# EAGLE design kulgurpowerMCU (EAGLE 6.3)

## Sheet 1 of 4
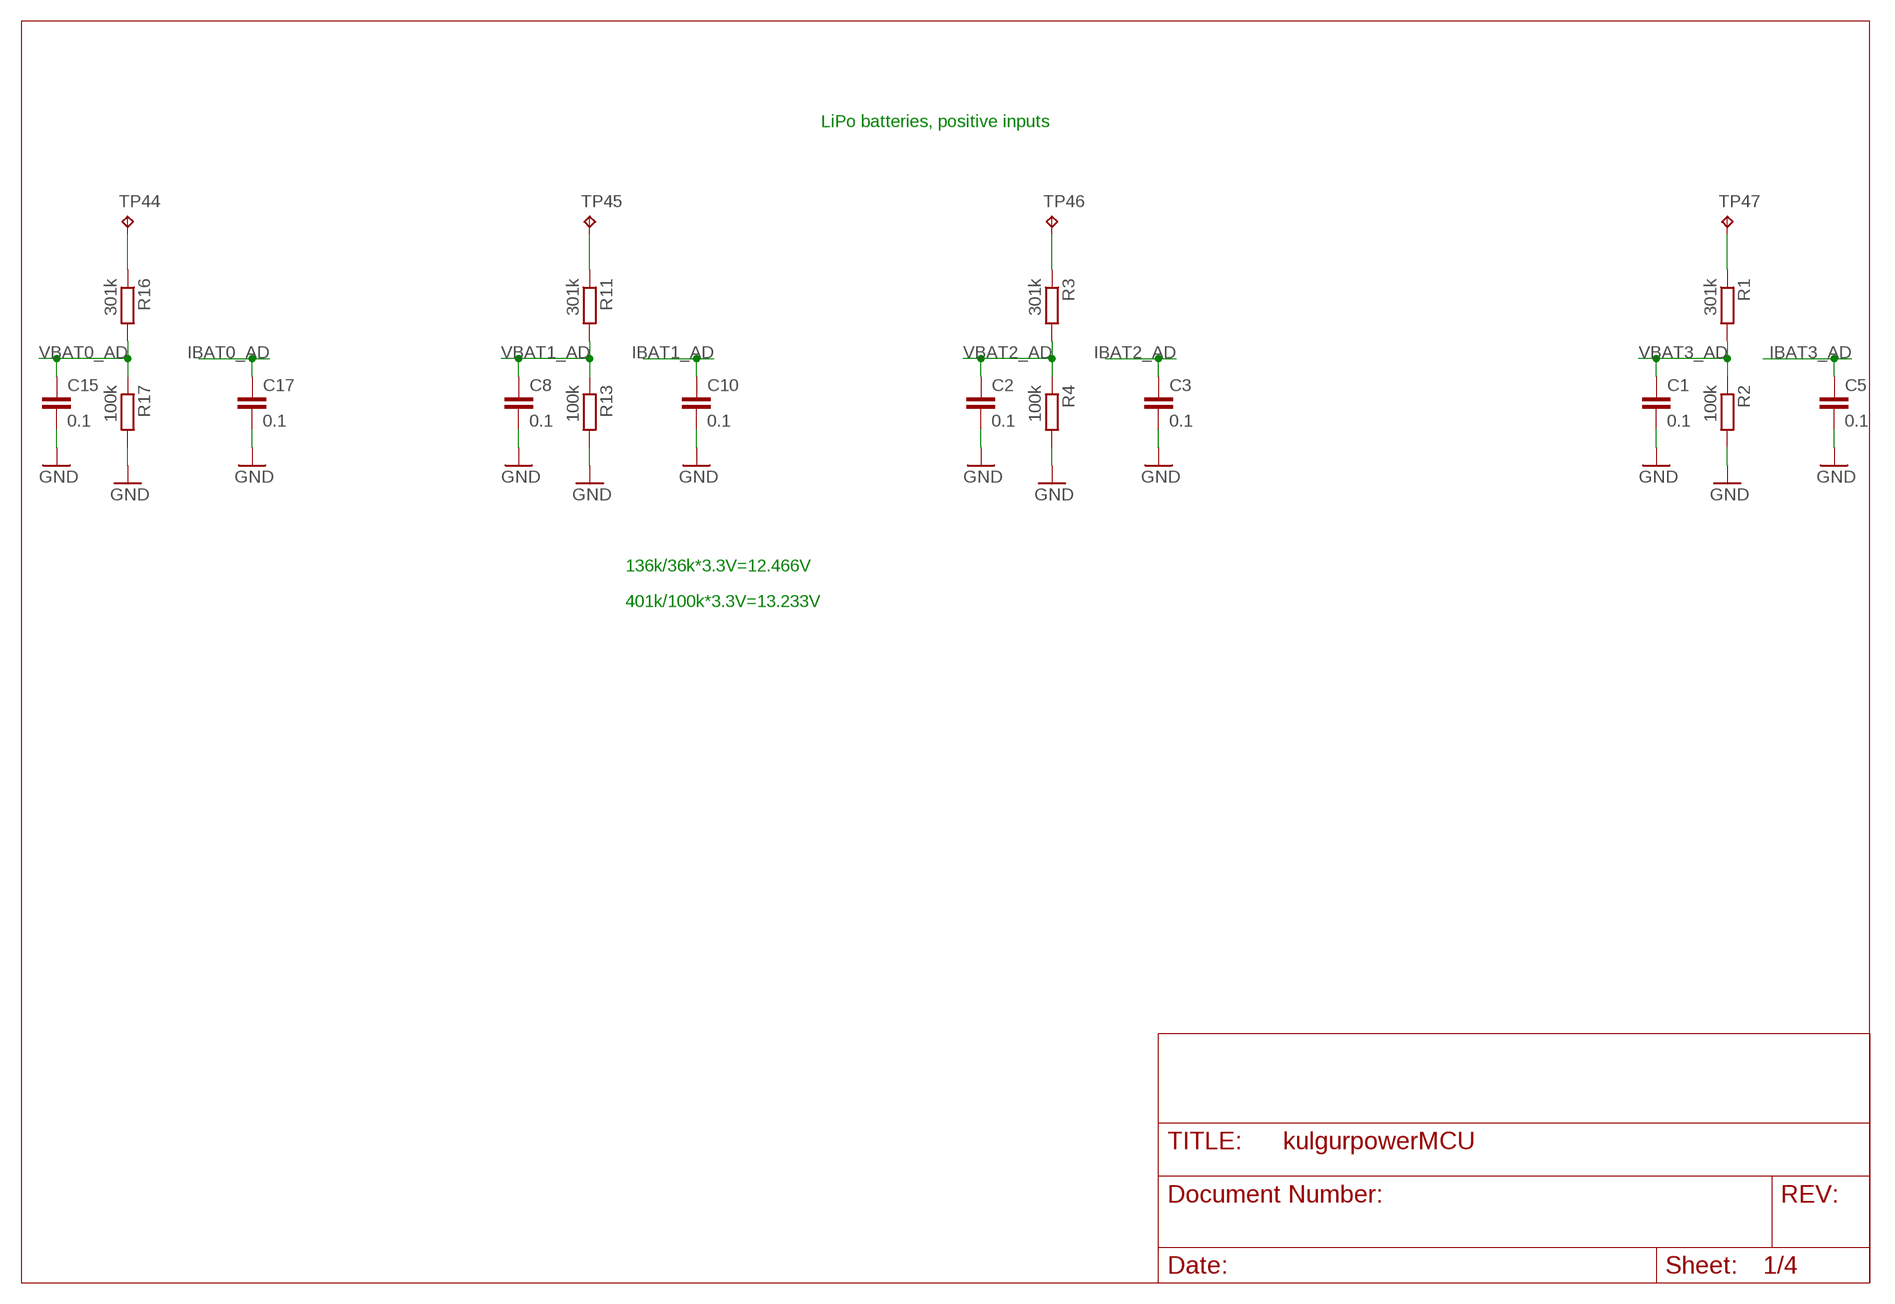
[diagram p0: schematic, sheet 1]

### Parts
C1  0.1  C-EUC0603  [C0603]
C2  0.1  C-EUC0603  [C0603]
C3  0.1  C-EUC0603  [C0603]
C5  0.1  C-EUC0603  [C0603]
C8  0.1  C-EUC0603  [C0603]
C10  0.1  C-EUC0603  [C0603]
C15  0.1  C-EUC0603  [C0603]
C17  0.1  C-EUC0603  [C0603]
R1  301k  R-EU_R0603  [R0603]
R2  100k  R-EU_R0603  [R0603]
R3  301k  R-EU_R0603  [R0603]
R4  100k  R-EU_R0603  [R0603]
R11  301k  R-EU_R0603  [R0603]
R13  100k  R-EU_R0603  [R0603]
R16  301k  R-EU_R0603  [R0603]
R17  100k  R-EU_R0603  [R0603]
TP44  TPB1,27  [B1,27]
TP45  TPB1,27  [B1,27]
TP46  TPB1,27  [B1,27]
TP47  TPB1,27  [B1,27]

### Nets
GND [gnd]: C1.2 C2.2 C3.2 C5.2 C8.2 C10.2 C15.2 C17.2 R2.2 R4.2 R13.2 R17.2 ; also sheet 2,3
IBAT0_AD: C17.1 ; also sheet 2
IBAT1_AD: C10.1 ; also sheet 2
IBAT2_AD: C3.1 ; also sheet 2
IBAT3_AD: C5.1 ; also sheet 2
N$10: R3.1 TP46.TP
N$13: R11.1 TP45.TP
N$22: R16.1 TP44.TP
N$24: R1.1 TP47.TP
VBAT0_AD: C15.1 R16.2 R17.1 ; also sheet 2
VBAT1_AD: C8.1 R11.2 R13.1 ; also sheet 2
VBAT2_AD: C2.1 R3.2 R4.1 ; also sheet 2
VBAT3_AD: C1.1 R1.2 R2.1 ; also sheet 2

### Notes on the sheet
- LiPo batteries, positive inputs
- 136k/36k*3.3V=12.466V
- 401k/100k*3.3V=13.233V

## Sheet 2 of 4
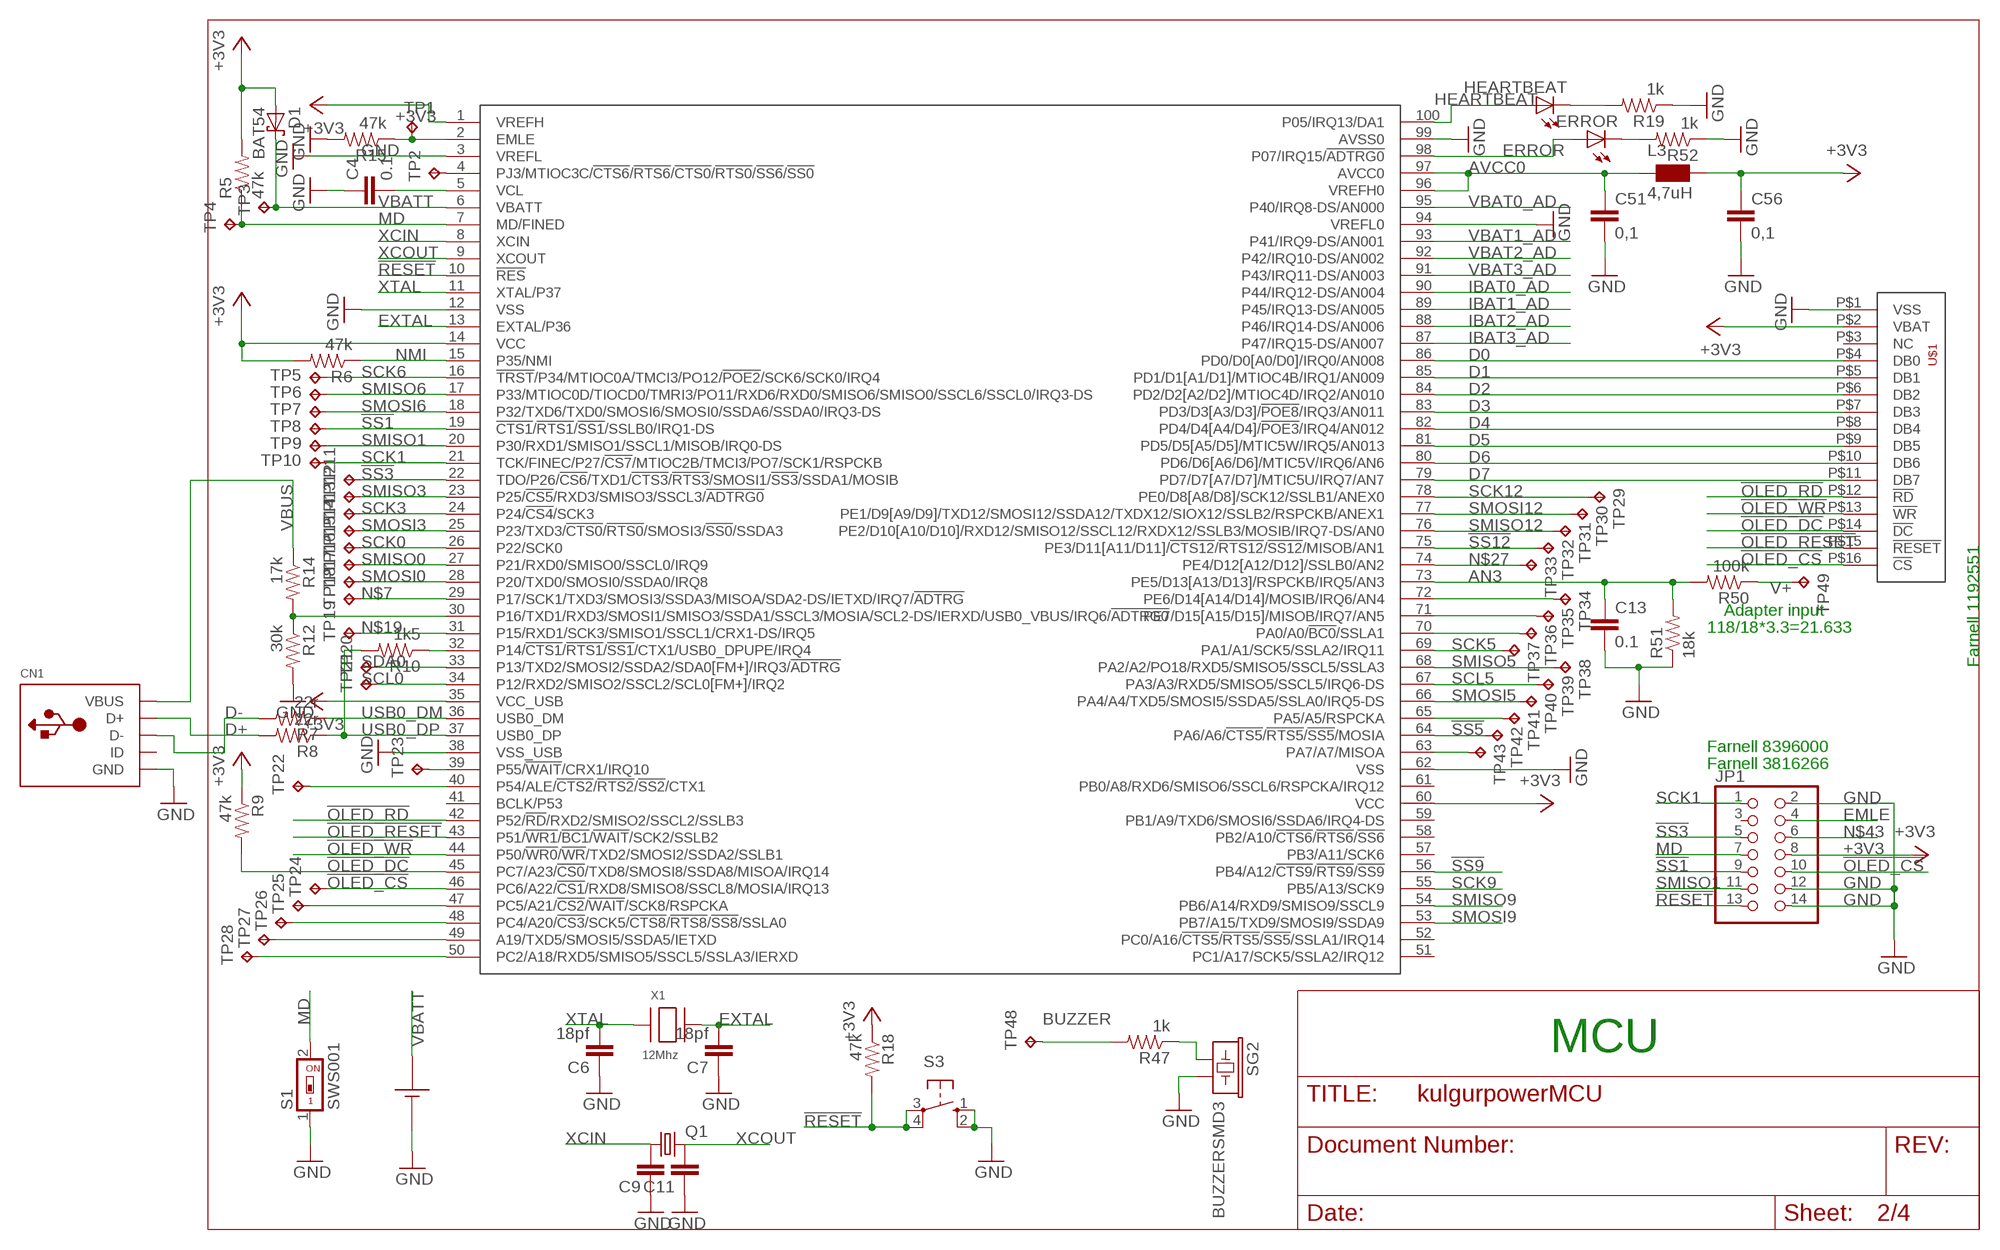
[diagram p1: schematic, sheet 2]

### Parts
C4  0.1  CAP0603-CAP  [0603-CAP]
C6  18pf  CAP0603-CAP  [0603-CAP]
C7  18pf  CAP0603-CAP  [0603-CAP]
C9  CAP0603-CAP  [0603-CAP]
C11  CAP0603-CAP  [0603-CAP]
C13  0.1  CAP0603-CAP  [0603-CAP]
C51  0,1  CAP0603-CAP  [0603-CAP]
C56  0,1  CAP0603-CAP  [0603-CAP]
CN1  USBMINIB  [USB-MINIB]
D1  BAT54  [SOT23]
ERROR  LED0603  [LED-0603]
HEARTBEAT  LED0603  [LED-0603]
JP1  PINHD-2X7  [2X07]
L3  4,7uH  WE-KIHQ_0805  [WE-KI_0805_B]
Q1  CRYSTALMM20SS  [MM20SS]
R5  47k  RESISTOR0603-RES  [0603-RES]
R6  47k  RESISTOR0603-RES  [0603-RES]
R7  22r  RESISTOR0603-RES  [0603-RES]
R8  22r  RESISTOR0603-RES  [0603-RES]
R9  47k  RESISTOR0603-RES  [0603-RES]
R10  1k5  RESISTOR0603-RES  [0603-RES]
R12  30k  RESISTOR0603-RES  [0603-RES]
R14  17k  RESISTOR0603-RES  [0603-RES]
R15  47k  RESISTOR0603-RES  [0603-RES]
R18  47k  RESISTOR0603-RES  [0603-RES]
R19  1k  RESISTOR0603-RES  [0603-RES]
R47  1k  RESISTOR0603-RES  [0603-RES]
R50  100k  RESISTOR0603-RES  [0603-RES]
R51  18k  RESISTOR0603-RES  [0603-RES]
R52  1k  RESISTOR0603-RES  [0603-RES]
S1  SWS001  [SMS-001]
S3  10-XX  [B3F-10XX]
SG2  BUZZERSMD3  [BUZZER-CMT1102]
TP1  TPB2,54  [B2,54]
TP2  TPB2,54  [B2,54]
TP3  TPB2,54  [B2,54]
TP4  TPB2,54  [B2,54]
TP5  TPB1,27  [B1,27]
TP6  TPB1,27  [B1,27]
TP7  TPB1,27  [B1,27]
TP8  TPB1,27  [B1,27]
TP9  TPB1,27  [B1,27]
TP10  TPB1,27  [B1,27]
TP11  TPB1,27  [B1,27]
TP12  TPB1,27  [B1,27]
TP13  TPB1,27  [B1,27]
TP14  TPB1,27  [B1,27]
TP15  TPB1,27  [B1,27]
TP16  TPB1,27  [B1,27]
TP17  TPB1,27  [B1,27]
TP18  TPB1,27  [B1,27]
TP19  TPB1,27  [B1,27]
TP20  TPB1,27  [B1,27]
TP21  TPB1,27  [B1,27]
TP22  TPB1,27  [B1,27]
TP23  TPB1,27  [B1,27]
TP24  TPB1,27  [B1,27]
TP25  TPB1,27  [B1,27]
TP26  TPB1,27  [B1,27]
TP27  TPB1,27  [B1,27]
TP28  TPB1,27  [B1,27]
TP29  TPB1,27  [B1,27]
TP30  TPB1,27  [B1,27]
TP31  TPB1,27  [B1,27]
TP32  TPB1,27  [B1,27]
TP33  TPB1,27  [B1,27]
TP34  TPB1,27  [B1,27]
TP35  TPB1,27  [B1,27]
TP36  TPB1,27  [B1,27]
TP37  TPB1,27  [B1,27]
TP38  TPB1,27  [B1,27]
TP39  TPB1,27  [B1,27]
TP40  TPB1,27  [B1,27]
TP41  TPB1,27  [B1,27]
TP42  TPB1,27  [B1,27]
TP43  TPB1,27  [B1,27]
TP48  TPB1,27  [B1,27]
TP49  TPB1,27  [B1,27]
U$1  ER-OLEDM032-1  [ER-OLEDM032-1]
U$2  EDLRD224V3R6C  [EDLRD224V3R6C]
U$14  R5F5630ADDFP  [LTQFP100]
X1  12Mhz  XTALNX5032  [NX5032]

### Nets
!OLED_CS: JP1.10 TP24.TP U$1.P$16(!CS) U$14.46(PC6/A22/!CS1!/RXD8/SMISO8/SSCL8/MOSIA/IRQ13)
!OLED_DC: R9.2 U$1.P$14(!DC) U$14.45(PC7/A23/!CS0!/TXD8/SMOSI8/SSDA8/MISOA/IRQ14)
!OLED_RD: U$1.P$12(!RD) U$14.42(P52/!RD!/RXD2/SMISO2/SSCL2/SSLB3)
!OLED_RESET: U$1.P$15(!RESET) U$14.43(P51/!WR1!/!BC1!/!WAIT!/SCK2/SSLB2)
!OLED_WR: U$1.P$13(!WR) U$14.44(P50/!WR0!/!WR!/TXD2/SMOSI2/SSDA2/SSLB1)
!RESET: JP1.13 R18.2 S3.3(P) S3.4(P1) U$14.10(!RES!) ; also sheet 3
!SS1: JP1.9 TP8.TP U$14.19(!CTS1!/!RTS1!/!SS1!/SSLB0/IRQ1-DS)
!SS3: JP1.5 TP11.TP U$14.22(TDO/P26/!CS6!/TXD1/!CTS3!/!RTS3!/SMOSI1/!SS3!/SSDA1/MOSIB)
!SS5: TP42.TP U$14.64(PA6/A6/!CTS5!/!RTS5!/!SS5!/MOSIA)
!SS9: U$14.56(PB4/A12/!CTS9!/!RTS9!/!SS9!)
!SS12: TP32.TP U$14.75(PE3/D11[A11/D11]/!CTS12!/!RTS12!/!SS12!/MISOB/AN1)
+3V3 [morepower]: C56.1 D1.1(A) JP1.8 L3.1 R5.2 R6.2 R9.1 R18.1 U$1.P$2(VBAT) U$14.1(VREFH) U$14.14(VCC) U$14.35(VCC_USB) U$14.60(VCC) ; also sheet 3
AN3: C13.1 R50.2 R51.2 U$14.73(PE5/D13[A13/D13]/RSPCKB/IRQ5/AN3)
AVCC0: C51.1 L3.2 U$14.96(VREFH0) U$14.97(AVCC0)
BUZZER: R47.2 TP48.TP
D0: U$1.P$4(DB0) U$14.86(PD0/D0[A0/D0]/IRQ0/AN008)
D1: U$1.P$5(DB1) U$14.85(PD1/D1[A1/D1]/MTIOC4B/IRQ1/AN009)
D2: U$1.P$6(DB2) U$14.84(PD2/D2[A2/D2]/MTIOC4D/IRQ2/AN010)
D3: U$1.P$7(DB3) U$14.83(PD3/D3[A3/D3]/!POE8!/IRQ3/AN011)
D4: U$1.P$8(DB4) U$14.82(PD4/D4[A4/D4]/!POE3!/IRQ4/AN012)
D5: U$1.P$9(DB5) U$14.81(PD5/D5[A5/D5]/MTIC5W/IRQ5/AN013)
D6: U$1.P$10(DB6) U$14.80(PD6/D6[A6/D6]/MTIC5V/IRQ6/AN6)
D7: U$1.P$11(DB7) U$14.79(PD7/D7[A7/D7]/MTIC5U/IRQ7/AN7)
D+: CN1.D+ R8.2
D-: CN1.D- R7.2
EMLE: JP1.4 R15.1 TP1.TP U$14.2(EMLE)
EN_PANDA: R47.1 SG2.1
ERROR: ERROR.A U$14.98(P07/IRQ15/!ADTRG0)
EXTAL: C7.2 U$14.13(EXTAL/P36) X1.P$2
GND [gnd]: C4.1 C6.1 C7.1 C9.1 C11.1 C13.2 C51.2 C56.2 CN1.GND JP1.2 JP1.12 JP1.14 R12.2 R15.2 R19.1 R51.1 R52.1 S1.1 S3.1(S) S3.2(S1) SG2.2 U$1.P$1(VSS) U$2.N U$14.3(VREFL) U$14.12(VSS) U$14.38(VSS_USB) U$14.62(VSS) U$14.94(VREFL0) U$14.99(AVSS0) ; also sheet 1,3
HEARTBEAT: HEARTBEAT.A U$14.100(P05/IRQ13/DA1)
IBAT0_AD: U$14.90(P44/IRQ12-DS/AN004) ; also sheet 1
IBAT1_AD: U$14.89(P45/IRQ13-DS/AN005) ; also sheet 1
IBAT2_AD: U$14.88(P46/IRQ14-DS/AN006) ; also sheet 1
IBAT3_AD: U$14.87(P47/IRQ15-DS/AN007) ; also sheet 1
MD: JP1.7 R5.1 S1.2 TP4.TP U$14.7(MD/FINED)
N$1: R10.1 U$14.32(P14/!CTS1!/!RTS1!/!SS1!/CTX1/USB0_DPUPE/IRQ4)
N$2: R12.1 R14.2 U$14.30(P16/TXD1/RXD3/SMOSI1/SMISO3/SSDA1/SSCL3/MOSIA/SCL2-DS/IERXD/USB0_VBUS/IRQ6/!ADTRG0!)
N$3: C4.2 U$14.5(VCL)
N$7: TP18.TP U$14.29(P17/SCK1/TXD3/SMOSI3/SSDA3/MISOA/SDA2-DS/IETXD/IRQ7/!ADTRG!)
N$12: TP25.TP U$14.47(PC5/A21/!CS2!/!WAIT!/SCK8/RSPCKA)
N$14: TP26.TP U$14.48(PC4/A20/!CS3!/SCK5/!CTS8!/!RTS8!/!SS8!/SSLA0)
N$15: TP27.TP U$14.49(A19/TXD5/SMOSI5/SSDA5/IETXD)
N$17: HEARTBEAT.C R19.2
N$18: TP28.TP U$14.50(PC2/A18/RXD5/SMISO5/SSCL5/SSLA3/IERXD)
N$19: TP19.TP U$14.31(P15/RXD1/SCK3/SMISO1/SSCL1/CRX1-DS/IRQ5)
N$21: TP2.TP U$14.4(PJ3/MTIOC3C/!CTS6!/!RTS6!/!CTS0!/!RTS0!/!SS6!/!SS0!)
N$25: TP22.TP U$14.40(P54/ALE/!CTS2!/!RTS2!/!SS2!/CTX1)
N$27: TP33.TP U$14.74(PE4/D12[A12/D12]/SSLB0/AN2)
N$28: TP23.TP U$14.39(P55/!WAIT!/CRX1/IRQ10)
N$29: ERROR.C R52.2
N$31: TP34.TP U$14.72(PE6/D14[A14/D14]/MOSIB/IRQ6/AN4)
N$32: TP35.TP U$14.71(PE7/D15[A15/D15]/MISOB/IRQ7/AN5)
N$33: TP36.TP U$14.70(PA0/A0/!BC0!/SSLA1)
N$34: TP41.TP U$14.65(PA5/A5/RSPCKA)
N$35: TP43.TP U$14.63(PA7/A7/MISOA)
N$43: JP1.6
NMI: R6.1 U$14.15(P35/NMI)
SCK0: TP15.TP U$14.26(P22/SCK0)
SCK1: JP1.1 TP10.TP U$14.21(TCK/FINEC/P27/!CS7!/MTIOC2B/TMCI3/PO7/SCK1/RSPCKB)
SCK3: TP13.TP U$14.24(P24/!CS4!/SCK3)
SCK5: TP37.TP U$14.69(PA1/A1/SCK5/SSLA2/IRQ11)
SCK6: TP5.TP U$14.16(!TRST!/P34/MTIOC0A/TMCI3/PO12/!POE2!/SCK6/SCK0/IRQ4)
SCK9: U$14.55(PB5/A13/SCK9)
SCK12: TP29.TP U$14.78(PE0/D8[A8/D8]/SCK12/SSLB1/ANEX0)
SCL0: TP21.TP U$14.34(P12/RXD2/SMISO2/SSCL2/SCL0[FM+]/IRQ2)
SCL5: TP39.TP U$14.67(PA3/A3/RXD5/SMISO5/SSCL5/IRQ6-DS)
SDA0: TP20.TP U$14.33(P13/TXD2/SMOSI2/SSDA2/SDA0[FM+]/IRQ3/!ADTRG!)
SMISO0: TP16.TP U$14.27(P21/RXD0/SMISO0/SSCL0/IRQ9)
SMISO1: JP1.11 TP9.TP U$14.20(P30/RXD1/SMISO1/SSCL1/MISOB/IRQ0-DS)
SMISO3: TP12.TP U$14.23(P25/!CS5!/RXD3/SMISO3/SSCL3/!ADTRG0!)
SMISO5: TP38.TP U$14.68(PA2/A2/PO18/RXD5/SMISO5/SSCL5/SSLA3)
SMISO6: TP6.TP U$14.17(P33/MTIOC0D/TIOCD0/TMRI3/PO11/RXD6/RXD0/SMISO6/SMISO0/SSCL6/SSCL0/IRQ3-DS)
SMISO9: U$14.54(PB6/A14/RXD9/SMISO9/SSCL9)
SMISO12: TP31.TP U$14.76(PE2/D10[A10/D10]/RXD12/SMISO12/SSCL12/RXDX12/SSLB3/MOSIB/IRQ7-DS/AN0)
SMOSI0: TP17.TP U$14.28(P20/TXD0/SMOSI0/SSDA0/IRQ8)
SMOSI3: TP14.TP U$14.25(P23/TXD3/!CTS0!/!RTS0!/SMOSI3/!SS0!/SSDA3)
SMOSI5: TP40.TP U$14.66(PA4/A4/TXD5/SMOSI5/SSDA5/SSLA0/IRQ5-DS)
SMOSI6: TP7.TP U$14.18(P32/TXD6/TXD0/SMOSI6/SMOSI0/SSDA6/SSDA0/IRQ3-DS)
SMOSI9: U$14.53(PB7/A15/TXD9/SMOSI9/SSDA9)
SMOSI12: TP30.TP U$14.77(PE1/D9[A9/D9]/TXD12/SMOSI12/SSDA12/TXDX12/SIOX12/SSLB2/RSPCKB/ANEX1)
USB0_DM: R7.1 U$14.36(USB0_DM)
USB0_DP: R8.1 R10.2 U$14.37(USB0_DP)
V+ [morepower]: R50.1 TP49.TP
VBAT0_AD: U$14.95(P40/IRQ8-DS/AN000) ; also sheet 1
VBAT1_AD: U$14.93(P41/IRQ9-DS/AN001) ; also sheet 1
VBAT2_AD: U$14.92(P42/IRQ10-DS/AN002) ; also sheet 1
VBAT3_AD: U$14.91(P43/IRQ11-DS/AN003) ; also sheet 1
VBATT: D1.3(C) TP3.TP U$2.P U$14.6(VBATT)
VBUS: CN1.VBUS R14.1 ; also sheet 3
XCIN: C9.2 Q1.1 U$14.8(XCIN)
XCOUT: C11.2 Q1.4 U$14.9(XCOUT)
XTAL: C6.2 U$14.11(XTAL/P37) X1.P$1
Unconnected: CN1.ID JP1.3 U$1.P$3(NC) U$14.41(BCLK/P53) U$14.51(PC1/A17/SCK5/SSLA2/IRQ12) U$14.52(PC0/A16/!CTS5!/!RTS5!/!SS5!/SSLA1/IRQ14) U$14.57(PB3/A11/SCK6) U$14.58(PB2/A10/!CTS6!/!RTS6!/!SS6!) U$14.59(PB1/A9/TXD6/SMOSI6/SSDA6/IRQ4-DS) U$14.61(PB0/A8/RXD6/SMISO6/SSCL6/RSPCKA/IRQ12)

### Notes on the sheet
- Adapter input
- 118/18*3.3=21.633
- Farnell 1192551
- Farnell 8396000
- Farnell 3816266
- MCU

## Sheet 3 of 4
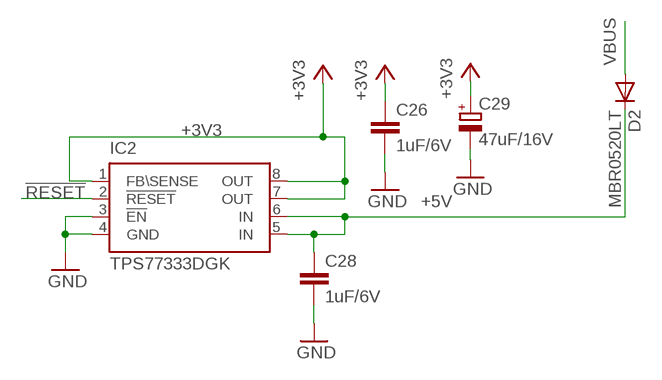
[diagram p2: schematic, sheet 3]

### Parts
C26  1uF/6V  C-EUC0603  [C0603]
C28  1uF/6V  C-EUC0603  [C0603]
C29  47uF/16V  CPOL-EUC/6032-28R  [C/6032-28R]
D2  MBR0520LT  [SOD123]
IC2  TPS77333DGK  TPS773  [MSOP8]

### Nets
!RESET: IC2.2(!RESET) ; also sheet 2
+3V3 [morepower]: C26.1 C29.+ IC2.1(FB\SENSE) IC2.7(OUT) IC2.8(OUT) ; also sheet 2
+5V [power]: C28.1 D2.C IC2.5(IN) IC2.6(IN)
GND [gnd]: C26.2 C28.2 C29.- IC2.3(!EN) IC2.4(GND) ; also sheet 1,2
VBUS: D2.A ; also sheet 2

## Sheet 4 of 4

## Library data of the parts
C1-C3 C5 C8 C10 C15 C17 = rcl:C-EU: CAPACITOR, European symbol
C4 C6 C7 C9 C11 C13 C51 C56 = SparkFun:CAP: Capacitor Standard 0603 ceramic capacitor, and 0.1" leaded capacitor.
C26 C28 = resistor:C-EU: CAPACITOR, European symbol
C29 = rcl:CPOL-EU: POLARIZED CAPACITOR, European symbol
CN1 = adafruit:USB: USB Connectors USBMINIB - Surface Mount Female Mini-B USB Connector 4UConnector: 06564 By microbuilder.eu Thru-hole RA Female Mini-B USB Connector 4UConnector: 18732 By ladyada.net
D1 = diode:BAT54: Schottky Diodes Source: Fairchild .. BAT54.pdf
D2 = diode:MBR0520LT: SCHOTTKY BARRIER RECTIFIER Source: http://onsemi.com .. MBR0520LT1-D.pdf
ERROR HEARTBEAT = SparkFun:LED: LEDs Standard schematic elements and footprints for 5mm, 3mm, 1206, and 0603 sized LEDs. 5mm - Spark Fun Electronics SKU : COM-00529 (and others)
IC2 = samuel:TPS773*: 250-mA LDO REGULATORS WITH RESET OUTPUT WITH 8-PIN MSOP PACKAGING Source: http://focus.ti.com/lit/ds/symlink/tps77333.pdf
JP1 = pinhead:PINHD-2X7: PIN HEADER
L3 = wuerth-elektronik:WE-KIHQ: SMD Wire Wound Ceramic Inductor WE-KIHQ - High current - Highest Quality factor in size 0805 - up to 98 - High thermal stability - High SRF -- Bluetooth -- Wireless LAN -- RF oscillation circuit -- IF impedance matching -- IG choke
Q1 = crystal:CRYSTAL: CRYSTAL; OC_FARNELL: unknown; OC_NEWARK: unknown
R1-R4 R11 R13 R16 R17 = rcl:R-EU_: RESISTOR, European symbol
R5-R10 R12 R14 R15 R18 R19 R47 R50-R52 = SparkFun:RESISTOR: Resistor Basic schematic elements and footprints for 0603, 1206, and PTH resistors.
S1 = smd-special:SWS001: SMD Dip Switch 1 pol.
S3 = switch-omron:10-XX: OMRON SWITCH; MPN: B3F-1000; OC_FARNELL: 176432; OC_NEWARK: 36M3542
SG2 = SparkFun:BUZZER: Buzzer 12mm Spark Fun Electronics SKU : Comp-Buzzer
TP1-TP49 = testpad:TP: Test pad
U$1 = oled:ER-OLEDM032-1
U$2 = supercap-EDLRD224V3R6C:EDLRD224V3R6C
U$14 = renesas_rx:R5F5630ADDFP
X1 = adafruit:XTAL: Low cost SMT crystals, no capacitors included http://www.ladyada.net/library/eagle

## Net classes
0 default: width 0.203 mm, drill 0.3 mm, clearance 0.203 mm
1 power: width 0.635 mm, drill 0.305 mm, clearance 0.203 mm
2 morepower: width 1.016 mm, drill 0.508 mm, clearance 0.203 mm
3 gnd: width 0.305 mm, drill 0.305 mm, clearance 0.203 mm

## Board
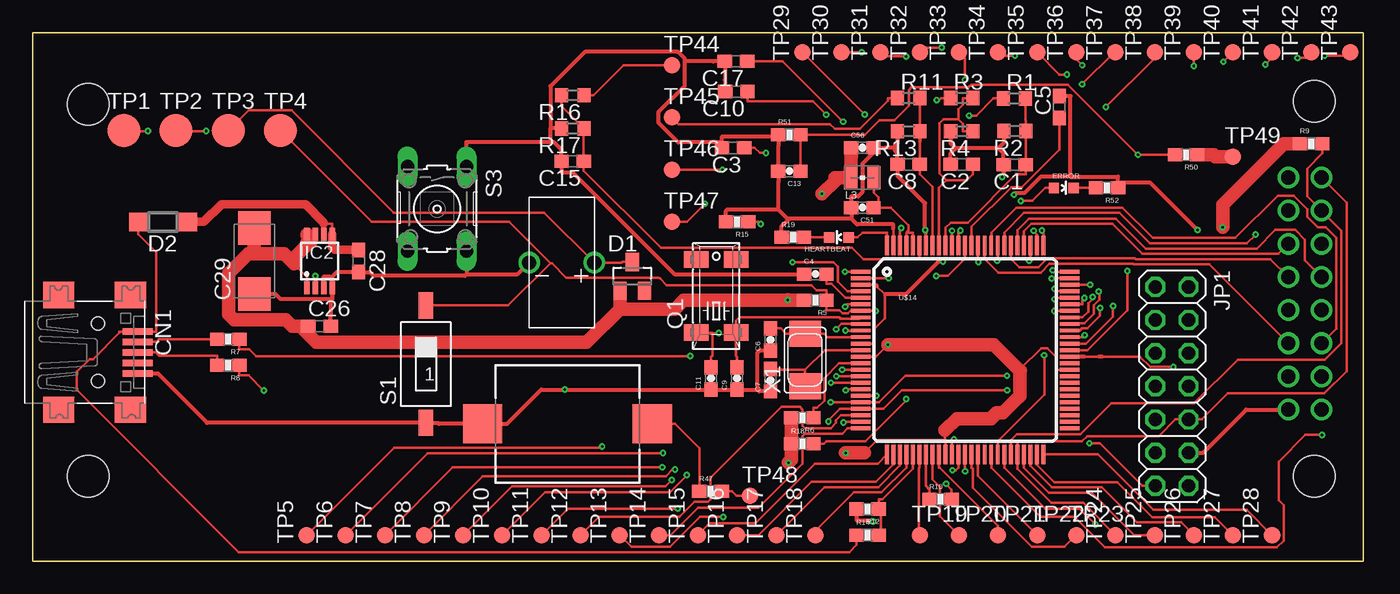
[diagram p3: board, top side]
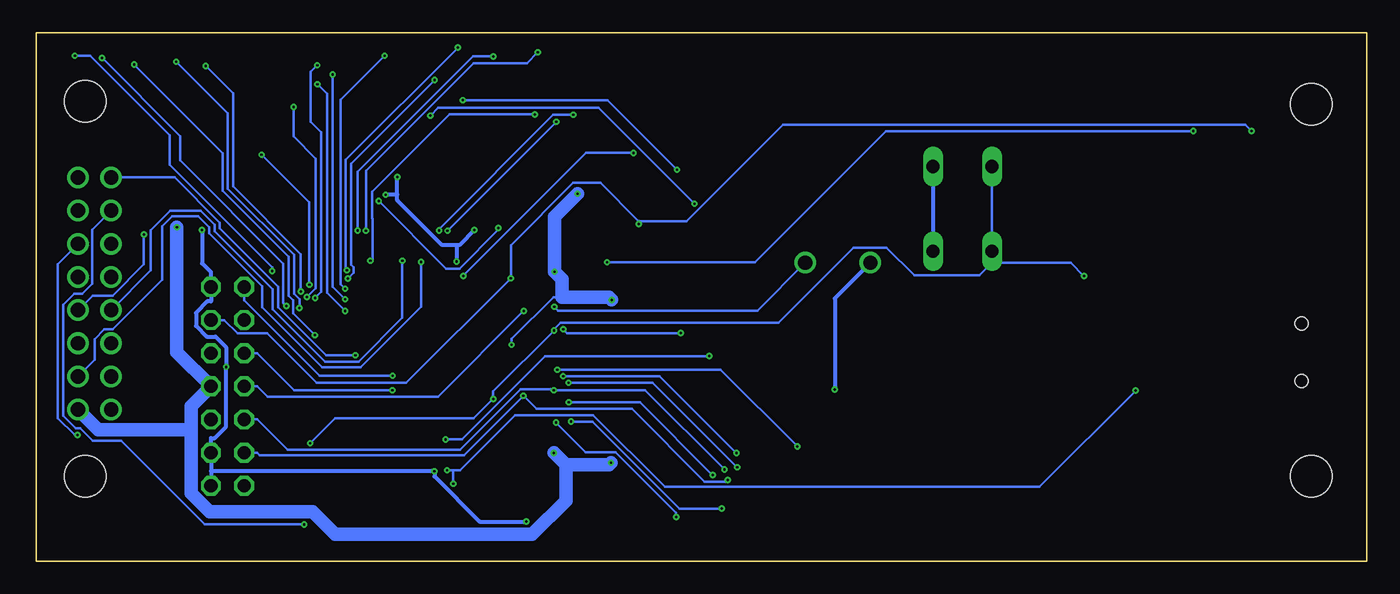
[diagram p4: board, bottom side, seen from below]

Size 102 x 40.5 mm. Coordinates in mm from the lower left corner, seen from the top.
Outline: 0,0 0,40.5 102,40.5 102,0 0,0
Copper layers (1*16): Top 0.035mm / dielectric 0.6mm / Bottom 0.035mm
Design rules "4mil_4lay2 *": minimum track width 6mil, minimum drill 7mil, track to track 6mil, track to pad 6mil, pad to pad 6mil, via to via 6mil, smd to smd 0mil, copper to edge 20mil, drill to drill 8mil, minimum pad ring 8mil, minimum via ring 6mil, stop-mask expansion 4mil, vias tented up to drill 18mil, thermal gap 10mil

### Footprints (pad centres in the part's own frame; a part is rotated, then mirrored left to right if it is on the bottom)
C0603 = smd 1.1 x 1: 1 -0.85,0; 2 0.85,0
0603-CAP = smd 1.1 x 1: 1 -0.85,0; 2 0.85,0
C/6032-28R = smd 2.55 x 2.5: + 2.525,0; - -2.525,0
USB-MINIB = smd 0.5 x 2.308: D+ 0,4.064; D- -0.8,4.064; GND 1.6,4.064; ID 0.8,4.064; VBUS -1.6,4.064 | smd 2 x 2.4: GND1 -4.4,-2; GND2 -4.4,3.5; GND3 4.4,3.5; GND4 4.4,-2 | hole 1: -2.2,1; 2.2,1
SOT23 = smd 1 x 1.4: 1 -0.95,-1.1; 2 0.95,-1.1; 3 0,1.1
SOD123 = smd 1.4 x 1.4: A 1.9,0; C -1.9,0
LED-0603 = smd 0.8 x 0.8: A 0,-0.75; C 0,0.75
MSOP8 = smd 0.45 x 1: 1 -0.975,-2.05; 2 -0.325,-2.05; 3 0.325,-2.05; 4 0.975,-2.05; 5 0.975,2.05; 6 0.325,2.05; 7 -0.325,2.05; 8 -0.975,2.05
2X07 = drill 1.016 octagon: 1 -7.62,-1.27; 2 -7.62,1.27; 3 -5.08,-1.27; 4 -5.08,1.27; 5 -2.54,-1.27; 6 -2.54,1.27; 7 0,-1.27; 8 0,1.27; 9 2.54,-1.27; 10 2.54,1.27; 11 5.08,-1.27; 12 5.08,1.27; 13 7.62,-1.27; 14 7.62,1.27
WE-KI_0805_B = smd 1.02 x 1.78: 1 -0.89,0; 2 0.89,0
MM20SS = smd 1.27 x 1.88: 1 -2.794,-1.524; 2 2.794,-1.524; 3 2.794,1.524; 4 -2.794,1.524
R0603 = smd 1 x 1.1: 1 -0.85,0; 2 0.85,0
0603-RES = smd 1.1 x 1: 1 -0.85,0; 2 0.85,0
SMS-001 = smd 1.092 x 2.007: 1 0,-4.496; 2 0,4.496
B3F-10XX = drill 1.016 long: 1 -3.251,2.261; 2 3.251,2.261; 3 -3.251,-2.261; 4 3.251,-2.261
BUZZER-CMT1102 = smd 3 x 3: 1 -6.5,0; 2 6.5,0
B2,54 = smd 2.54 x 2.54: TP 0,0
B1,27 = smd 1.27 x 1.27: TP 0,0
ER-OLEDM032-1 = drill 1.1: P$1 95.25,7.62; P$2 97.79,7.62; P$3 95.25,10.16; P$4 97.79,10.16; P$5 95.25,12.7; P$6 97.79,12.7; P$7 95.25,15.24; P$8 97.79,15.24; P$9 95.25,17.78; P$10 97.79,17.78; P$11 95.25,20.32; P$12 97.79,20.32; P$13 95.25,22.86; P$14 97.79,22.86; P$15 95.25,25.4; P$16 97.79,25.4 | hole 3.2: 3.25,31; 3.25,2.5; 97.25,2.5; 97.25,31.25
EDLRD224V3R6C = drill 1.1: N 2.5,0; P -2.5,0
LTQFP100 = smd 1.5 x 0.3: 1 -8,6; 2 -8,5.5; 3 -8,5; 4 -8,4.5; 5 -8,4; 6 -8,3.5; 7 -8,3; 8 -8,2.5; 9 -8,2; 10 -8,1.5; 11 -8,1; 12 -8,0.5; 13 -8,0; 14 -8,-0.5; 15 -8,-1; 16 -8,-1.5; 17 -8,-2; 18 -8,-2.5; 19 -8,-3; 20 -8,-3.5; 21 -8,-4; 22 -8,-4.5; 23 -8,-5; 24 -8,-5.5; 25 -8,-6; 51 8,-6; 52 8,-5.5; 53 8,-5; 54 8,-4.5; 55 8,-4; 56 8,-3.5; 57 8,-3; 58 8,-2.5; 59 8,-2; 60 8,-1.5; 61 8,-1; 62 8,-0.5; 63 8,0; 64 8,0.5; 65 8,1; 66 8,1.5; 67 8,2; 68 8,2.5; 69 8,3; 70 8,3.5; 71 8,4; 72 8,4.5; 73 8,5; 74 8,5.5; 75 8,6 | smd 0.3 x 1.5: 26 -6,-8; 27 -5.5,-8; 28 -5,-8; 29 -4.5,-8; 30 -4,-8; 31 -3.5,-8; 32 -3,-8; 33 -2.5,-8; 34 -2,-8; 35 -1.5,-8; 36 -1,-8; 37 -0.5,-8; 38 0,-8; 39 0.5,-8; 40 1,-8; 41 1.5,-8; 42 2,-8; 43 2.5,-8; 44 3,-8; 45 3.5,-8; 46 4,-8; 47 4.5,-8; 48 5,-8; 49 5.5,-8; 50 6,-8; 76 6,8; 77 5.5,8; 78 5,8; 79 4.5,8; 80 4,8; 81 3.5,8; 82 3,8; 83 2.5,8; 84 2,8; 85 1.5,8; 86 1,8; 87 0.5,8; 88 0,8; 89 -0.5,8; 90 -1,8; 91 -1.5,8; 92 -2,8; 93 -2.5,8; 94 -3,8; 95 -3.5,8; 96 -4,8; 97 -4.5,8; 98 -5,8; 99 -5.5,8; 100 -6,8
NX5032 = smd 2 x 2.4: P$1 2,0; P$2 -2,0

### Placement (x,y rotation side)
C1  75.28,30.39 180 top
C2  71.22,30.4 180 top
C3  53.69,31.67 180 top
C4  60,22 0 top
C5  78.69,34.81 90 top
C6  56.57,16.98 90 top
C7  56.56,13.87 90 top
C8  67.15,30.4 180 top
C9  54,14 90 top
C10  53.94,35.99 180 top
C11  52,14 90 top
C13  58.01,29.89 180 top
C15  41.4,30.66 180 top
C17  53.91,38.31 180 top
C26  22,18 0 top
C28  25,23 270 top
C29  17,23 90 top
C51  63.6,27.1 180 top
C56  63.6,31.67 0 top
CN1  4,16 270 top
D1  45.96,21.83 0 top
D2  10,26 180 top
ERROR  79.03,28.61 270 top
HEARTBEAT  61.82,24.81 90 top
IC2  22,23 0 top
JP1  87.33,13.4 270 top
L3  63.6,29.38 0 top
Q1  52.4,20.32 90 top
R1  75.26,35.45 0 top
R2  75.29,32.96 180 top
R3  71.22,35.48 0 top
R4  71.22,32.94 180 top
R5  60,20 180 top
R6  59,11 180 top
R7  15,17 180 top
R8  15,15 180 top
R9  98,32 0 top
R10  69.59,4.74 0 top
R11  67.15,35.48 0 top
R12  64,4 180 top
R13  67.15,32.94 180 top
R14  64,2 0 top
R15  54,26 180 top
R16  41.4,35.7 180 top
R17  41.4,33.16 180 top
R18  59,9 0 top
R19  58.26,24.81 0 top
R47  51.96,5.35 0 top
R50  88.41,31.15 180 top
R51  58.01,32.69 0 top
R52  82.35,28.61 180 top
S1  30.15,15.1 0 top
S3  31,27 270 top
SG2  41,10.53 180 top
TP1  7,33 0 top
TP2  11,33 0 top
TP3  15,33 0 top
TP4  19,33 0 top
TP5  21,2 90 top
TP6  24,2 90 top
TP7  27,2 90 top
TP8  30,2 90 top
TP9  33,2 90 top
TP10  36,2 90 top
TP11  39,2 90 top
TP12  42,2 90 top
TP13  45,2 90 top
TP14  48,2 90 top
TP15  51,2 90 top
TP16  54,2 90 top
TP17  57,2 90 top
TP18  60,2 90 top
TP19  68,2 0 top
TP20  71,2 0 top
TP21  74,2 0 top
TP22  77,2 0 top
TP23  80,2 0 top
TP24  83,2 90 top
TP25  86,2 90 top
TP26  89,2 90 top
TP27  92,2 90 top
TP28  95,2 90 top
TP29  59,39 90 top
TP30  62,39 90 top
TP31  65,39 90 top
TP32  68,39 90 top
TP33  71,39 90 top
TP34  74,39 90 top
TP35  77,39 90 top
TP36  80,39 90 top
TP37  83,39 90 top
TP38  86,39 90 top
TP39  89,39 90 top
TP40  92,39 90 top
TP41  95,39 90 top
TP42  98,39 90 top
TP43  101,39 90 top
TP44  49,38 0 top
TP45  49,34 0 top
TP46  49,30 0 top
TP47  49,26 0 top
TP48  55,5 0 top
TP49  92,31 0 top
U$1  1,4 0 top
U$2  40.55,22.87 180 top
U$14  71.47,16.18 0 top
X1  59.21,15.42 90 top

### Tracks (layer width: path | path; a pad name or v marks a point on that pad's centre or on a via)
!OLED_CS
  Top 0.203: U$1.P$16 100.73,27.46 100.73,14.56 99.02,12.86 91.62,12.86 89.62,10.86 JP1.10 87.59,10.86 86.32,9.59 80.85,9.59 80.44,9.18 75.47,9.18 U$14.46 75.47,7.08 78.08,4.47 80.53,4.47 TP24.TP
!OLED_DC
  Top 0.203: U$14.45 74.97,9.26 75.45,9.73 80.31,9.73 82.67,12.09 89.02,12.09 92.36,15.43 99.06,15.43 100.32,16.7 100.32,25.33 U$1.P$14 97.69,27.96 97.69,30.09 98.85,31.25 R9.2
!OLED_RD  (via drill 0.18 pad 0.48)
  Top 0.203: U$14.42 73.47,7.17 77.23,3.41 79.84,3.41 82.2,1.06 95.38,1.06 95.9,1.57 95.9,4.27 95.52,4.65 95.52,7.64 97.56,9.67 v98.83,9.67
  Bottom 0.203: v98.83,9.67 99.05,9.67 100.34,10.97 100.34,22.77 U$1.P$12
!OLED_RESET  (via drill 0.18 pad 0.48)
  Top 0.203: v77.54,15.78 77.54,12.75 73.97,9.18 U$14.43
  Bottom 0.203: U$1.P$15 91.38,29.4 87.92,25.94 87.92,25.5 83.46,21.04 83.46,19.45 79.78,15.78 v77.54,15.78
!OLED_WR  (via drill 0.18 pad 0.48)
  Top 0.203: v81.45,2.81 80.24,4.03 77.61,4.03 74.47,7.17 U$14.44
  Bottom 0.203: U$1.P$13 97.71,25.4 97.71,21.27 98.47,20.51 99.07,20.51 99.93,19.65 99.93,11.15 98.95,10.17 98.63,10.17 97.68,9.22 95.5,9.22 89.09,2.81 v81.45,2.81
!RESET  (via drill 0.18 pad 0.48)
  Top 0.203: v80.99,9.03 81.79,9.03 85.05,5.78 JP1.13 | R18.2 60.65,9 60.85,9.2 63.84,9.2 66.96,12.32 v66.96,12.44 | v21.68,21.85 IC2.2 | U$14.10 v62.31,17.68
  Bottom 0.203: v80.99,9.03 79.09,10.94 68.46,10.94 v66.96,12.44 66.96,13.02 v62.31,17.68 62.31,17.76 61.8,18.27 45.09,18.27 39.35,24.01 36.81,24.01 34.7,21.9 29.7,21.9 28.74,22.86 | 28.74,22.86 S3.4 S3.3 | 28.74,22.86 22.68,22.86 v21.68,21.85
!SS1  (via drill 0.18 pad 0.48)
  Top 0.203: TP8.TP 34.51,6.5 48.53,6.5 49.06,7.03 v49.24,7.03 | U$14.19 62.39,13.18 v62.32,13.1
  Bottom 0.203: v49.24,7.03 55.32,13.1 v62.32,13.1 62.4,13.19 64.87,13.19 69.52,8.54 82.73,8.54 85.05,10.86 JP1.9
!SS3  (via drill 0.18 pad 0.48)
  Top 0.203: TP11.TP 41.03,4.03 v49.45,4.03 | v60.99,10.7 60.99,10.8 61.87,11.68 U$14.22 65.22,11.68 66.64,13.1 v74.69,13.1
  Bottom 0.203: v60.99,10.7 59.37,10.7 52.7,4.03 v49.45,4.03 | v74.69,13.1 82.21,13.1 85.05,15.94 JP1.5
!SS5  (via drill 0.18 pad 0.48)
  Top 0.203: U$14.64 80.74,16.68 82.81,18.75 v82.81,19.56 | v96.95,38.56 97.56,38.56 TP42.TP
  Bottom 0.203: v96.95,38.56 90.95,32.56 90.95,30.7 83.05,22.81 83.05,19.8 v82.81,19.56
!SS12  (via drill 0.18 pad 0.48)
  Top 0.203: U$14.75 78.47,22.18 78.35,22.29 v78.17,22.29 | TP32.TP 68.35,39.35 v69.67,39.35
  Bottom 0.203: v69.67,39.35 78.26,30.76 78.26,22.38 v78.17,22.29
+3V3  (via drill 0.18 pad 0.48)
  Top 0.203: 75.72,14.6 75.72,14.73 77.31,16.33 77.77,16.33 78.42,15.68 78.42,14.68 U$14.60 | IC2.7 21.68,24.25 21.02,24.25 | IC2.1 21.02,21.75 20.03,22.75 20.03,22.8 | 63.74,8.3 64.72,9.28 69.94,9.28 | U$14.1 v62.26,22.18 | 69.94,9.28 69.97,9.24 U$14.35 | 69.94,9.28 69.94,10.02 | 21.02,24.44 21.02,24.97 | v65.56,16.59 64.64,15.68 U$14.14 | 75.67,12.64 75.62,12.64 | 73.89,11.39 73.89,11.32 | 73.82,11.32 73.82,11.25 | 73.75,11.25 73.75,11.18 | 73.68,11.18 73.68,11.11 | 73.61,11.11 73.61,11.04 | 73.54,11.04 73.54,10.97 | 73.47,10.97 73.47,10.91
  Top 1.016: R9.1 95.89,32 91.22,27.33 v91.22,25.59 | v62.32,8.3 63.74,8.3 | v57.94,7.54 57.94,7.58 58.15,7.79 R18.1 R6.2 | 20.52,18 21.74,16.78 42.47,16.78 45.01,19.31 | 20.52,18 19.89,18 19.4,18.49 15.45,18.49 15.02,18.92 15.02,22.06 16.5,23.54 17,23.54 | C26.1 20.52,18 | 57.89,20 49.91,20 49.22,19.31 45.01,19.31 | D1.1 45.01,19.31 | v57.89,20.02 57.89,20 | R5.2 57.89,20 | 73.89,11.39 74.37,11.39 75.62,12.64 | v60.51,28.15 61.48,29.13 61.48,29.38 L3.1 62.71,30.98 62.75,31.02 C56.1 | 73.47,10.91 70.83,10.91 69.94,10.02 | 75.67,14.6 73.68,16.59 v65.56,16.59 | 75.67,12.64 75.67,14.6 | 75.67,14.6 75.72,14.6 | 19.8,23.02 20.03,22.8 | 19.8,23.02 21.02,24.25 21.02,24.44 | IC2.8 21.02,24.97 | 73.89,11.32 73.82,11.32 | 73.82,11.25 73.75,11.25 | 73.75,11.18 73.68,11.18 | 73.68,11.11 73.61,11.11 | 73.61,11.04 73.54,11.04 | 73.54,10.97 73.47,10.97 | C29.+ 17,23.54 | 17,23.54 19.29,23.54 19.8,23.02
  Bottom 0.203: 61.68,20.23 62.35,20.23 65.56,17.03 v65.56,16.59
  Bottom 1.016: v91.22,25.59 91.22,16.01 JP1.8 90.13,11.87 90.13,10.06 | 61.4,7.38 61.4,4.63 63.97,2.06 79.06,2.06 80.8,3.8 88.7,3.8 90.13,5.22 90.13,10.06 | U$1.P$2 97.23,10.06 90.13,10.06 | 61.4,7.38 v62.32,8.3 | v57.94,7.54 58.1,7.38 61.4,7.38 | v57.89,20.02 58.1,20.23 61.68,20.23 61.68,21.59 v62.26,22.18 62.26,26.4 v60.51,28.15
+5V
  Top 0.203: 22.32,25.86 22.98,25.86 IC2.5 | 22.32,25.86 | IC2.6 22.32,25.86
  Top 0.635: 22.32,25.86 22.32,25.95 20.92,27.36 14.48,27.36 13.12,26 D2.C | IC2.5 22.98,24.03 23.15,23.85 23.98,23.85 C28.1
AN3  (via drill 0.18 pad 0.48)
  Top 0.203: v81.06,21.18 80.47,21.18 U$14.73 | R50.2 86.76,31.15 v84.72,31.15 79.36,36.51 71.95,36.51 71.74,36.31 67.36,36.31 67.15,36.1 67.15,34.9 66.05,33.8 64.92,33.8 63.81,32.69 59.66,32.69 R51.2 58.86,30.65 C13.1
  Bottom 0.203: v84.72,31.15 81.06,27.48 v81.06,21.18
AVCC0
  Top 0.203: 66.97,25.18 67.14,25.35 67.14,25.75 65.79,27.1 65.25,27.1 64.85,27.1 | L3.2 64.49,28.24 64.85,27.88 64.85,27.1 | C51.1 64.85,27.1 | 66.97,25.18 67.47,25.18 U$14.96 | U$14.97 66.97,25.18
BUZZER
  Top 0.203: R47.2 53.61,5.35 53.96,5 TP48.TP
D0  (via drill 0.18 pad 0.48)
  Top 0.203: U$14.86 72.47,23.17 72.5,23.15 v72.5,22.92
  Bottom 0.203: U$1.P$4 97.52,15.43 97.52,17.02 96.76,17.78 96.14,17.78 92.35,21.56 92.35,25.65 91.56,26.44 89.57,26.44 88.73,25.61 88.73,25.13 84.68,21.07 84.68,19.47 80.09,14.88 77.12,14.88 72.5,19.5 v72.5,22.92
D1
  Top 0.203: U$1.P$5 90.21,22.74 84.38,22.74 84.31,22.8 77.95,22.8 77.27,22.11 74.03,22.11 72.97,23.17 U$14.85
D2
  Top 0.203: U$1.P$6 99.92,17.83 99.92,24.78 99.11,25.59 98.49,25.59 97.71,26.38 97.71,26.95 96.66,28 95.42,28 92.2,24.77 85.86,24.77 83.53,27.1 75.39,27.1 73.47,25.18 U$14.84
D3  (via drill 0.18 pad 0.48)
  Top 0.203: U$14.83 73.97,23.17 73.93,23.13 v73.93,23.02
  Bottom 0.203: U$1.P$7 93.21,22.28 93.21,25.38 91.73,26.85 89.41,26.85 88.33,25.77 88.33,25.3 83.86,20.83 83.86,19.29 79.86,15.29 77.28,15.29 73.93,18.64 v73.93,23.02
D4  (via drill 0.18 pad 0.48)
  Top 0.203: v93.74,25.03 93.08,24.37 85.62,24.37 83.3,26.69 75.98,26.69 74.47,25.18 U$14.82
  Bottom 0.203: U$1.P$8 97.68,20.35 96.14,20.35 93.75,22.74 v93.75,25.03 v93.74,25.03
D5
  Top 0.203: U$1.P$9 94.88,23.15 84.54,23.15 84.48,23.21 77.78,23.21 77.1,22.52 75.62,22.52 74.97,23.17 U$14.81
D6
  Top 0.203: U$14.80 75.47,25.35 76.38,26.25 83.04,26.25 85.34,23.96 93.81,23.96 95.25,25.4 96.76,25.4 97.52,24.64 97.52,23.05 U$1.P$10
D7
  Top 0.203: U$1.P$11 95.48,23.55 85.07,23.55 82.78,25.85 76.55,25.85 75.97,25.27 75.97,25.18 U$14.79
D+
  Top 0.203: CN1.D+ 9.47,16 9.72,15.75 14.15,15.75 R8.2
D-
  Top 0.203: CN1.D- 9.47,16.8 9.67,17 R7.2
EMLE  (via drill 0.18 pad 0.48)
  Top 0.203: v55.81,25.84 55.65,26 R15.1 | v8.84,32.96 7.04,32.96 TP1.TP | v65.61,21.68 U$14.2
  Bottom 0.203: v65.61,21.68 73.63,13.66 80.5,13.66 84.3,17.46 86.57,17.46 87.59,18.48 JP1.4 | 55.81,26.07 v55.81,25.84 | v8.84,32.96 9.34,33.46 44.74,33.46 52.13,26.07 55.81,26.07 | 55.81,26.07 58.74,29 60.84,29 65.61,24.22 v65.61,21.68 | v65.61,21.68
EN_PANDA
  Top 0.203: R47.1 51.11,6.1 51.11,8.67 49.26,10.53 SG2.1
ERROR  (via drill 0.18 pad 0.48)
  Top 0.203: v75.74,27.61 76.63,27.61 77.62,28.61 ERROR.A | U$14.98 66.47,25.41 v66.58,25.52
  Bottom 0.203: v66.58,25.52 66.58,25.39 69.54,22.43 70.56,22.43 v75.74,27.61
EXTAL
  Top 0.203: U$14.13 60.72,16.18 59.22,14.67 | C7.2 57.32,14.72 57.36,14.67 59.22,14.67 | X1.P$2 59.22,14.67
GND  (via drill 0.18 pad 0.48)
  Top 0.203: 64.69,21.07 65.33,20.44 65.33,18.6 64.53,17.8 64.53,16.68 U$14.12 | 68.47,25.35 68.44,25.35 | U$14.99 65.97,25.5 | 80.61,15.68 81.75,15.68 | U$14.62 80.37,15.68 | U$14.94 68.47,25.13 | 65.97,25.64 65.97,25.8 | 64.64,21.18 U$14.3 | 81.96,15.68 84.88,15.68 85.66,14.89 v87.44,14.89 | U$14.38 v71.47,6.9
  Top 0.305: 83.2,29.03 85.63,29.03 v89.28,25.38 | 83.2,29.03 83.2,29.46 79.54,29.46 | R52.1 83.2,29.03 | 39.7,32.13 39.92,32.13 40.55,31.51 C15.2 40.55,29.8 41.4,29.8 49.2,22 C4.1 | 39.7,32.13 33.26,32.13 S3.1 | 39.7,32.13 39.7,33.16 | 64.9,31.67 64.83,31.67 63.6,30.45 63.6,28.27 63.28,27.95 62.75,27.95 C51.2 62.75,26.24 | 64.9,31.67 65.35,31.67 66.11,31.67 | C56.2 64.9,31.67 | 66.11,31.67 66.11,31.84 66.3,32.03 R13.2 | 66.11,31.67 66.11,31.45 66.3,31.26 C8.2 66.3,30.39 66.3,29.54 68.4,27.44 v68.4,25.38 68.44,25.35 | 57.92,26.18 57.41,25.67 R19.1 | 62.75,26.24 57.99,26.24 57.92,26.18 | 57.92,26.18 57.16,26.95 | 57.16,26.95 53.24,26.95 53.15,26.86 R15.2 | 57.16,26.95 57.16,29.04 C13.2 57.16,30.75 57.16,31.83 57.16,32.48 57.16,32.53 | 49.99,38.31 49.99,38.49 49.45,39.03 42.33,39.03 39.7,36.4 39.7,33.16 | 52.84,32.1 49.47,32.1 47.99,33.58 47.99,34.42 49.99,36.42 49.99,38.31 | 49.99,38.31 52.16,38.31 C17.2 53.06,36.88 53.09,36.84 C10.2 | 52.84,32.1 52.84,32.53 | C3.2 52.84,32.1 | R17.2 39.7,33.16 | 79.54,29.46 77.28,29.46 76.03,28.21 75.33,28.21 v75.21,28.08 | 55.58,13.15 55.71,13.02 C7.1 | 55.58,13.15 C9.1 C11.1 v40.78,13.15 38.98,13.15 36.36,10.53 SG2.2 31.13,10.53 31.05,10.61 S1.1 13.37,10.61 9.57,14.4 CN1.GND | 55.58,13.15 55.58,15.99 55.71,16.13 C6.1 | v69.77,22.98 69.48,22.98 66.95,20.44 65.33,20.44 | 33.26,22 37.18,22 U$2.N | 33.26,22 33.13,21.87 26.14,21.87 25.86,22.15 C28.2 24.14,22.15 23.32,22.15 22.98,21.81 22.98,21.59 | S3.2 33.26,22 | JP1.12 89.72,8.32 93.02,11.62 U$1.P$1 | 79.54,29.46 79.54,35.66 C5.2 | v74.32,29.43 74.42,29.54 74.42,30.09 C1.2 74.42,31.25 74.03,31.64 | 22.98,21.59 22.76,21.81 22.32,21.81 IC2.3
  Top 0.305: 22.98,21.59 22.98,21.38 IC2.4 22.98,20.09 22.85,20.09 | 74.03,31.64 70.75,31.64 | 74.03,31.64 74.44,32.06 R2.2 | 70.75,31.64 70.37,31.26 C2.2 | 70.75,31.64 70.37,32.03 R4.2 | 65.97,25.5 65.97,25.64 | v64.43,3.04 64.32,3.14 63.15,3.14 R12.2 | 57.16,32.53 52.84,32.53 | 52.84,32.53 | R51.1 57.16,32.53 | 80.61,15.68 80.37,15.68 | C29.- 18.61,20.48 18.99,20.09 22.85,20.09 | 22.85,20.09 | 22.85,20.09 22.85,18.86 C26.2 | 65.97,25.8 63.18,25.8 62.75,26.24 | 68.47,25.13 68.47,25.35 | 64.69,21.07 64.69,21.12 64.64,21.18 | 81.96,15.68 81.75,15.68
  Bottom 0.305: v89.28,25.38 89.28,22.81 88.6,22.14 JP1.2 88.6,19.9 88.88,19.9 89.75,19.04 89.75,18.03 88.92,17.21 88.25,17.21 87.44,16.39 v87.44,14.89 87.44,10.32 88.32,9.44 88.6,9.44 JP1.12 88.6,6.9 | 74.32,28.08 v74.32,29.43 | 69.77,24.23 70.88,24.23 74.32,27.66 74.32,28.08 | 74.32,28.08 v75.21,28.08 | v68.4,25.38 69.56,24.23 69.77,24.23 | 69.77,24.23 v69.77,22.98 | S3.1 S3.2 | U$2.N 40.78,20.15 v40.78,13.15 | v64.43,3.04 68,3.04 71.47,6.5 v71.47,6.9 88.6,6.9 | 88.6,6.9 JP1.14
HEARTBEAT
  Top 0.203: HEARTBEAT.A 63.22,24.81 63.59,25.18 65.47,25.18 U$14.100
IBAT0_AD  (via drill 0.18 pad 0.48)
  Top 0.203: C17.1 57.49,38.31 v62.12,33.67 | v70.47,25.32 70.47,25.18 U$14.90
  Bottom 0.203: v70.47,25.32 v62.12,33.67
IBAT1_AD  (via drill 0.18 pad 0.48)
  Top 0.203: v60.83,34.2 59.8,35.23 54.79,35.23 C10.1 | U$14.89 70.97,25.18 v71.11,25.33
  Bottom 0.203: v71.11,25.33 71.11,25.45 62.36,34.2 v60.83,34.2
IBAT2_AD  (via drill 0.18 pad 0.48)
  Top 0.203: U$14.88 71.47,23.17 70.16,21.86 v69.26,21.86 | C3.1 55.34,31.67 55.73,31.28 v56.21,31.28
  Bottom 0.203: v69.26,21.86 59.84,31.28 v56.21,31.28
IBAT3_AD
  Top 0.203: C5.1 78.69,31.51 75.84,28.66 75.02,28.66 71.97,25.62 71.97,25.18 U$14.87
MD  (via drill 0.18 pad 0.48)
  Top 0.203: v64.63,19.18 64.47,19.18 U$14.7 62.67,19.18 62.49,19 62.08,19 61.84,19.25 60.85,19.25 R5.1 60.85,20.75 60.1,20.75 59.7,21.15 48.6,21.15 48.08,21.66 48.05,21.66 47.98,21.73 40.9,21.73 39.8,22.83 39.69,22.83 | 39.69,22.83 | S1.2 36.46,19.6 39.69,22.83 | 39.69,22.83 36.52,26 26,26 TP4.TP
  Bottom 0.203: v64.63,19.18 71.21,12.6 84.24,12.6 85.05,13.4 JP1.7
N$1
  Top 0.203: R10.1 68.74,5.49 68.47,5.76 U$14.32
N$2
  Top 0.203: U$14.30 67.47,7.09 65.13,4.75 64.85,4.75 R12.1 65.01,3.84 65.01,2.16 R14.2
N$3
  Top 0.203: C4.2 60.85,21.25 61.25,21.25 62.32,20.18 U$14.5
N$7
  Top 0.203: TP18.TP 60,2.34 62.94,5.28 65.08,5.28 66.97,7.17 U$14.29
N$10  (via drill 0.18 pad 0.48)
  Top 0.203: TP46.TP v52.88,30 | R3.1 69.61,35.48 69.46,35.33 v69.28,35.33
  Bottom 0.203: v69.28,35.33 58.2,35.33 v52.88,30
N$12
  Top 0.203: U$14.47 75.97,7.15 77.88,5.25 81.2,5.25 84.45,2 TP25.TP
N$13
  Top 0.203: TP45.TP 49.5,33.5 61.13,33.5 61.49,33.14 63.42,33.14 65.55,35.26 65.55,35.48 R11.1
N$14
  Top 0.203: U$14.48 76.47,7.3 78.11,5.65 81.95,5.65 84.64,2.97 88.03,2.97 TP26.TP
N$15
  Top 0.203: U$14.49 76.97,7.41 78.32,6.06 83.15,6.06 85.84,3.37 90.63,3.37 TP27.TP
N$17
  Top 0.203: R19.2 HEARTBEAT.C
N$18
  Top 0.203: U$14.50 81.66,8.18 85.91,3.93 93.07,3.93 TP28.TP
N$19
  Top 0.203: U$14.31 67.97,7.17 67.94,7.14 67.94,2.06 TP19.TP
N$21  (via drill 0.18 pad 0.48)
  Top 0.203: U$14.4 62.47,20.68 61.72,21.43 61.72,22.57 61.38,22.91 v58.23,22.91 | TP2.TP 11.04,32.96 v13.3,32.96
  Bottom 0.203: v13.3,32.96 36.87,32.96 46.92,22.91 v58.23,22.91
N$22
  Top 0.203: R16.1 43.01,35.7 45.3,38 TP44.TP
N$24  (via drill 0.18 pad 0.48)
  Top 0.203: TP47.TP 50.14,26 v51.53,27.39 | R1.1 73.65,35.45 72.33,34.14 v71.78,34.14
  Bottom 0.203: v71.78,34.14 71.18,34.74 58.88,34.74 v51.53,27.39
N$25
  Top 0.203: U$14.40 72.47,6.53 TP22.TP
N$27  (via drill 0.18 pad 0.48)
  Top 0.203: U$14.74 78.12,21.68 v78.11,21.66 | v71.45,36.87 71.45,38.55 TP33.TP
  Bottom 0.203: v71.45,36.87 77.85,30.46 77.85,22.7 77.68,22.53 77.68,22.09 v78.11,21.66
N$28
  Top 0.203: U$14.39 71.97,7.17 72.06,7.08 72.06,5.63 76.59,1.1 79.1,1.1 TP23.TP
N$29
  Top 0.203: R52.2 ERROR.C
N$31  (via drill 0.18 pad 0.48)
  Top 0.203: U$14.72 78.47,20.68 78.47,20.74 v78.32,20.88 | v75.3,38.73 74.27,38.73 TP34.TP
  Bottom 0.203: v75.3,38.73 78.68,35.35 78.68,21.23 v78.32,20.88
N$32  (via drill 0.18 pad 0.48)
  Top 0.203: U$14.71 78.42,20.18 v78.31,20.07 | v79.27,37.29 78.71,37.29 TP35.TP
  Bottom 0.203: v78.31,20.07 79.27,21.02 v79.27,37.29
N$33  (via drill 0.18 pad 0.48)
  Top 0.203: v80.62,20.18 80.47,20.03 80.47,19.68 U$14.70 | v80.45,38.01 80,38.46 TP36.TP
  Bottom 0.203: v80.45,38.01 80.95,37.51 80.95,33.67 80.16,32.88 80.16,20.64 v80.62,20.18
N$34  (via drill 0.18 pad 0.48)
  Top 0.203: U$14.65 80.48,17.18 v80.62,17.32 | v94.49,38.05 95,38.56 TP41.TP
  Bottom 0.203: v94.49,38.05 87.72,31.28 87.72,28.38 82.64,23.31 82.64,20.33 82.32,20 82.32,19.01 v80.62,17.32
N$35  (via drill 0.18 pad 0.48)
  Top 0.203: TP43.TP 100.73,38.73 v99.03,38.73 | U$14.63 80.85,16.18 83.91,19.23 v83.91,22.23
  Bottom 0.203: v83.91,22.23 83.91,22.5 91.76,30.36 91.76,32.63 97.86,38.73 v99.03,38.73
NMI
  Top 0.203: R6.1 59.85,11.75 60.13,11.75 60.68,12.3 60.68,14.04 61.82,15.18 U$14.15
SCK0
  Top 0.203: U$14.26 64.78,7.48 59.98,7.48 55.39,2.89 51.89,2.89 TP15.TP
SCK1  (via drill 0.18 pad 0.48)
  Top 0.203: TP10.TP 39.29,5.29 48.84,5.29 v50.15,6.6 | v74.68,14.21 66.89,14.21 64.85,12.18 64.47,12.18 U$14.21 v61.17,12.18
  Bottom 0.203: v74.68,14.21 80.27,14.21 86.06,20 JP1.1 | v50.15,6.6 55.72,12.18 v61.17,12.18
SCK3  (via drill 0.18 pad 0.48)
  Top 0.203: v62.15,10.62 62.21,10.68 62.47,10.68 U$14.24 | TP13.TP 45.89,1.11 48.86,1.11 51.15,3.4 v52.94,3.4
  Bottom 0.203: v52.94,3.4 52.94,3.69 57.6,8.36 59.89,8.36 v62.15,10.62
SCK5  (via drill 0.18 pad 0.48)
  Top 0.203: v78.32,19.18 78.47,19.18 U$14.69 | v80.44,36.54 82.9,39 TP37.TP
  Bottom 0.203: v80.44,36.54 79.71,35.81 79.71,20.57 v78.32,19.18
SCK6  (via drill 0.18 pad 0.48)
  Top 0.203: U$14.16 v62.06,14.68 | v43.65,8.8 43.55,8.7 27.7,8.7 TP5.TP
  Bottom 0.203: v62.06,14.68 49.53,14.68 v43.65,8.8
SCK12  (via drill 0.18 pad 0.48)
  Top 0.203: TP29.TP v63.77,34.23 | U$14.78 76.47,23.11 v76.38,23.02
  Bottom 0.203: v76.38,23.02 76.22,23.18 76.22,26.25 76.24,26.27 76.24,28.32 70.32,34.23 v63.77,34.23
SCL0
  Top 0.203: U$14.34 69.47,7.17 69.55,7.17 74,2.72 TP21.TP
SCL5  (via drill 0.18 pad 0.48)
  Top 0.203: U$14.67 79.54,18.24 80.63,18.24 81.33,18.94 81.33,19.61 81.75,20.03 81.75,20.64 v81.71,20.68 | v89,37.95 TP39.TP
  Bottom 0.203: v89,37.95 86.9,35.85 86.9,28.72 81.71,23.53 v81.71,20.68
SDA0
  Top 0.203: TP20.TP 69.55,3.45 69.55,5.7 68.97,6.28 U$14.33
SMISO0
  Top 0.203: TP16.TP 55.62,2 59.71,6.09 64.64,6.09 65.97,7.42 U$14.27
SMISO1  (via drill 0.18 pad 0.48)
  Top 0.203: TP9.TP 36.76,5.76 48.52,5.76 | 48.52,5.76 | 48.52,5.76 v48.98,6.22 | v64.65,12.68 64.47,12.68 U$14.20
  Bottom 0.203: v48.98,6.22 49.09,6.11 50.78,6.11 56.34,11.66 63.64,11.66 v64.65,12.68 69.19,8.13 84.86,8.13 85.05,8.32 JP1.11
SMISO3
  Top 0.203: TP12.TP 43.42,3.42 49.59,3.42 50.73,4.55 51.75,4.55 51.96,4.77 51.96,6.38 57.4,11.82 58.82,11.82 59.02,11.61 59.02,10.39 59.22,10.2 61.2,10.2 61.59,10.6 61.59,10.81 61.95,11.18 62.47,11.18 U$14.23
SMISO5  (via drill 0.18 pad 0.48)
  Top 0.203: v81.25,20.24 81.25,20.11 80.92,19.78 80.92,19.12 80.47,18.68 U$14.68 | v82.26,34.81 86,38.55 TP38.TP
  Bottom 0.203: v81.25,20.24 80.56,20.93 | 80.56,20.93 | 80.56,20.93 80.56,30.85 82.26,32.55 v82.26,34.81
SMISO6  (via drill 0.18 pad 0.48)
  Top 0.203: U$14.17 v61.6,14.18 | v48.31,8.29 30.29,8.29 TP6.TP
  Bottom 0.203: v48.31,8.29 54.2,14.18 v61.6,14.18
SMISO12  (via drill 0.18 pad 0.48)
  Top 0.203: v77.36,25.34 77.47,25.22 77.47,25.18 U$14.76 | TP31.TP 65.32,38.68 v66.96,38.68
  Bottom 0.203: v77.36,25.34 77.36,29.84 68.52,38.68 v66.96,38.68
SMOSI0
  Top 0.203: TP17.TP 60.69,5.68 64.81,5.68 66.47,7.34 U$14.28
SMOSI3
  Top 0.203: TP14.TP 48.88,2 50.99,4.11 55.66,4.11 59.03,7.48 59.03,9.59 59.21,9.77 62.06,9.77 62.47,10.18 U$14.25
SMOSI5  (via drill 0.18 pad 0.48)
  Top 0.203: U$14.66 80.28,17.68 80.44,17.84 80.85,17.84 81.82,18.81 v81.82,19.4 | v81.82,19.4 | v91.27,38.27 TP40.TP
  Bottom 0.203: v91.27,38.27 87.31,34.31 87.31,28.55 82.23,23.48 82.23,20.49 81.82,20.08 v81.82,19.4
SMOSI6  (via drill 0.18 pad 0.48)
  Top 0.203: TP7.TP 32.2,7.21 v48.27,7.21 | U$14.18 v61.19,13.68
  Bottom 0.203: v48.27,7.21 54.74,13.68 v61.19,13.68
SMOSI12  (via drill 0.18 pad 0.48)
  Top 0.203: v76.72,25.32 76.72,25.27 76.97,25.02 U$14.77 | TP30.TP v63.55,39
  Bottom 0.203: v76.72,25.32 76.72,29.9 68.45,38.17 64.39,38.17 v63.55,39
USB0_DM  (via drill 0.18 pad 0.48)
  Top 0.203: v70.62,9.33 70.47,9.19 70.47,9.18 U$14.36 | R7.1 15.85,16.25 16.6,16.25 17.13,15.72 v50.41,15.72
  Bottom 0.203: v50.41,15.72 62.98,15.72 69.37,9.33 v70.62,9.33
USB0_DP  (via drill 0.18 pad 0.48)
  Top 0.203: R8.1 15.85,14.25 16.55,14.25 v17.73,13.07 | v70.5,6.97 70.76,6.97 70.97,7.17 U$14.37 | v70.03,5.94 70.03,5.9 70.44,5.49 R10.2
  Bottom 0.203: 70.03,6.97 v70.5,6.97 | v70.03,5.94 70.03,6.97 | 70.03,6.97 69.52,6.97 65.28,11.2 59.3,11.2 53.78,5.69 25.11,5.69 v17.73,13.07
V+
  Top 1.016: R50.1 90.52,31.15 90.67,31 TP49.TP
VBAT0_AD
  Top 0.203: U$14.95 67.97,23.17 67.92,23.12 63.68,23.12 62.8,24 48.15,24 42.24,29.9 C15.1 R17.1 | R17.1 40.55,34.85 R16.2 | R17.1
VBAT1_AD
  Top 0.203: U$14.93 68.97,28.68 68,29.65 C8.1 68,32.14 | R11.2 R13.1 68,32.54
  Top 0.25: 68,32.14 68,32.54
VBAT2_AD
  Top 0.203: 70.96,33.85 71.31,33.51 71.31,32.94 R4.1 | 70.04,29.2 69.51,29.72 69.51,33.57 69.8,33.85 70.96,33.85 | 70.96,33.85 70.96,34.63 71.31,34.98 71.31,35.48 R3.2 | 70.04,29.2 71.62,29.2 72.07,29.65 C2.1 | U$14.92 69.47,28.63 70.04,29.2
VBAT3_AD
  Top 0.203: U$14.91 69.97,25.54 70.38,25.95 71.68,25.95 75.37,29.64 76.13,29.64 C1.1 76.13,32.14 76.14,32.16 R2.1 76.14,33.77 76.11,33.8 R1.2
VBATT  (via drill 0.18 pad 0.48)
  Top 0.203: U$14.6 62.47,19.68 62.47,19.67 v62.29,19.49 | TP3.TP 16.56,34.56 19.84,34.56 27.68,26.71 39.21,26.71 U$2.P 45.15,22.87 45.21,22.93 D1.3
  Bottom 0.203: U$2.P 46.72,19.21 62,19.21 v62.29,19.49
VBUS
  Top 0.203: R14.1 63.15,1.25 62.6,0.7 15.81,0.7 3.38,13.13 3.38,14.5 4.36,15.48 4.64,15.48 6.66,17.5 6.66,17.6 CN1.VBUS 9.47,17.6 9.47,23.67 8.1,25.05 D2.A
XCIN
  Top 0.203: U$14.8 63.38,18.59 61.91,18.59 61.83,18.68 54.19,18.68 53.92,18.41 Q1.1 53.92,15.73 54,15.65 C9.2
XCOUT  (via drill 0.18 pad 0.48)
  Top 0.203: C11.2 52,15.65 52.11,15.76 52.11,17.48 | v52.59,17.48 52.11,17.48 | Q1.4 52.07,17.52 52.11,17.48 | U$14.9 62,18.18 v61.59,17.77
  Bottom 0.203: v61.59,17.77 61.31,17.48 v52.59,17.48
XTAL
  Top 0.203: U$14.11 60.91,17.18 60.67,17.42 X1.P$1 57.76,17.42 57.35,17.83 C6.2